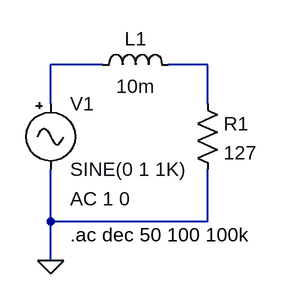
[diagram p0: schematic P3.asc]
P3.asc, the LTspice schematic file:
Version 4.1
SHEET 1 880 680
WIRE 96 96 32 96
WIRE 224 96 176 96
WIRE 32 144 32 96
WIRE 224 144 224 96
WIRE 32 288 32 224
WIRE 224 288 224 224
WIRE 224 288 32 288
WIRE 32 336 32 288
FLAG 32 336 0
SYMBOL ind 80 112 R270
WINDOW 0 32 56 VTop 2
WINDOW 3 5 56 VBottom 2
SYMATTR InstName L1
SYMATTR Value 10m
SYMATTR SpiceLine Rser=1m
SYMBOL Misc\\signal 32 128 R0
WINDOW 123 24 132 Left 2
WINDOW 39 0 0 Left 0
SYMATTR InstName V1
SYMATTR Value2 AC 1 0
SYMBOL res 208 128 R0
SYMATTR InstName R1
SYMATTR Value 127
TEXT 56 304 Left 2 !.ac dec 50 100 100k

The netlist it stands for:
* P3.asc
L1 N001 N002 10m Rser=1m
V1 N001 0 SINE(0 1 1K) AC 1 0
R1 N002 0 127
.ac dec 50 100 100k
.backanno
.end